# Altium schematic sheet AuxBattery.SCHDOC
size A4; Organization: UNSW Solar Racing Team; Address3: UNSW; Address4: Sydney NSW 2052; Address2: Electrical Engineering; Address1: Rm 109
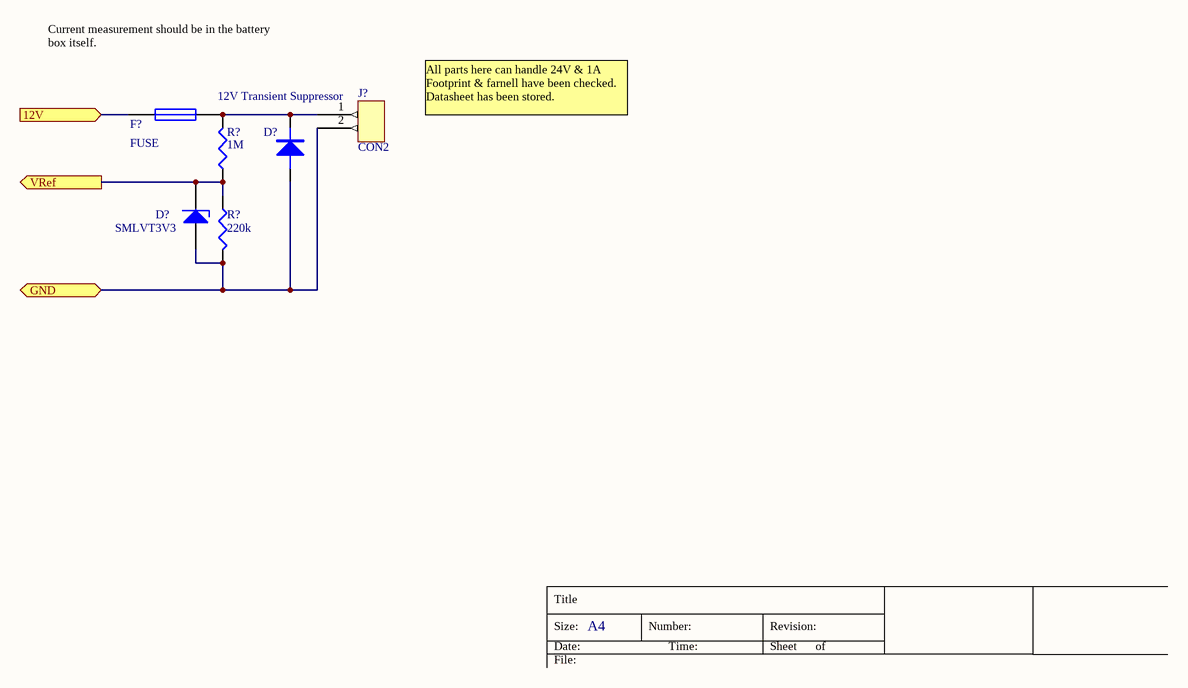
[diagram p0: AuxBattery.SCHDOC]

## Parts
(Parts that share a designator on the sheet are numbered #1, #2 ... from top to bottom, then left to right.)
D?#1  12V Transient Suppressor  [SMA]
D?#2  SMLVT3V3  [SMB]
F?  FUSE  [LITTELFUSE-154]
J?  CON2  [MICROFIT-2]
R?#1  1M  [0603]
R?#2  220k  [0603]

## Ports
12V (in), GND (bidir), VRef (out)

## Nets
12V: F?.1 ; port 12V
GND: D?#1.A D?#2.A J?.2 R?#2.2 ; port GND
VRef: D?#2.K R?#1.1 R?#2.1 ; port VRef
NetD?#1_K: D?#1.K F?.2 J?.1 R?#1.2

## Notes on the sheet
- Current measurement should be in the battery box itself.
- All parts here can handle 24V & 1A
  Footprint & farnell have been checked.
  Datasheet has been stored.
- Title
- Size:
- Date:
- A4
- Number:
- Time:
- Revision:
- Sheet
- of
- File:

## Library data of the parts
D?#1 = DIODE: Farnell: 302-3096; Price: 1.25
D?#2 = ZENER1: TVS; Farnell: 9802886; Price: 1.10
J? = CON2: Microfit 2-way PCB Connector; Farnell: 1012251; Price: 2.64
R?#1 R?#2 = RES1: Price: 0.06
  R?#1: Farnell: 9330410
  R?#2: Farnell: 9330836
F? = FUSE: Farnell: 9943609; Price: 7.78